# EAGLE design 1stschem (EAGLE 7.2.0)
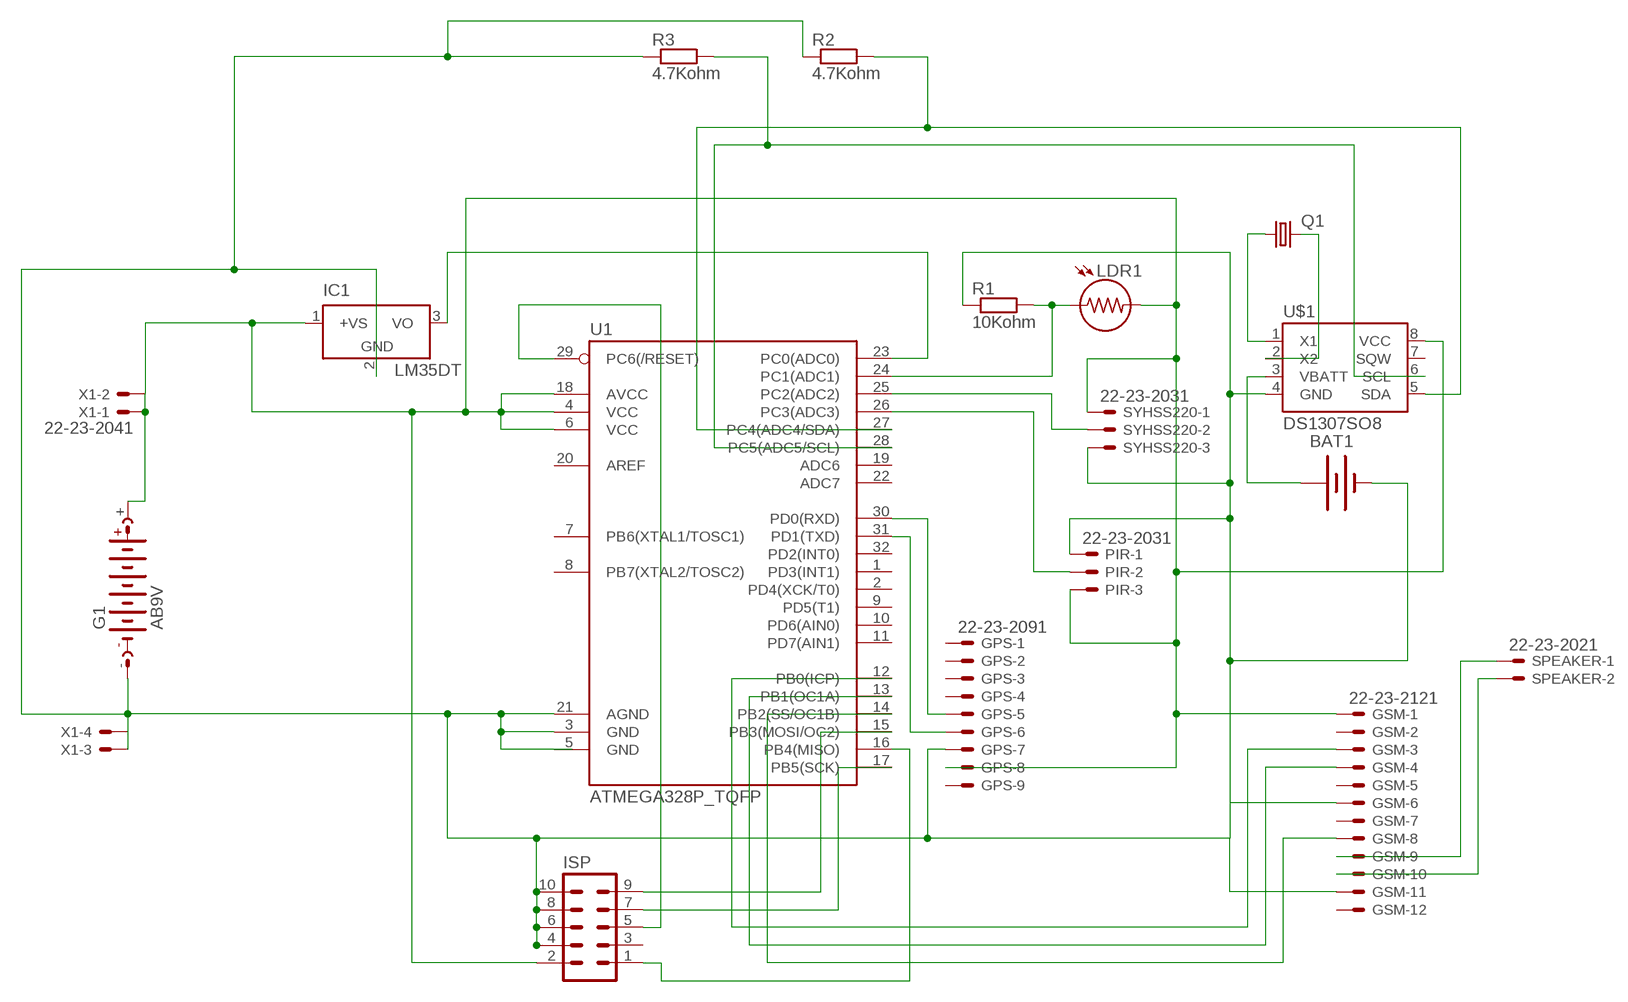
[diagram p0: schematic, sheet 1]

## Parts
BAT1  BATTERY20PTH  [BATTCOM_20MM_PTH]
G1  AB9V  [AB9V]
GPS  22-23-2091  [22-23-2091]
GSM  22-23-2121  [22-23-2121]
IC1  LM35DT  [TO220V]
ISP  ML10  [ML10]
LDR1  LDR5MM  [LDR338-54C]
PIR  22-23-2031  [22-23-2031]
Q1  CRYSTALTC26H  [TC26H]
R1  10Kohm  6MM-EU4  [R0207/4]
R2  4.7Kohm  6MM-EU4  [R0207/4]
R3  4.7Kohm  6MM-EU4  [R0207/4]
SPEAKER  22-23-2021  [22-23-2021]
SYHSS220  22-23-2031  [22-23-2031]
U1  ATMEGA328P_TQFP  [TQFP32-08]
U$1  DS1307SO8  [SO08]
X1  22-23-2041  [22-23-2041]

## Nets
N$2: BAT1.2(-) G1.- GPS.7 GSM.6 GSM.11 IC1.2(GND) ISP.4 ISP.6 ISP.8 ISP.10 PIR.1 R1.1 R2.1 R3.1 SYHSS220.3 U1.3(GND) U1.21(AGND) U$1.4(GND) X1.3 X1.4
N$3: GPS.5 U1.30(PD0(RXD))
N$4: IC1.3(VO) U1.23(PC0(ADC0))
N$5: LDR1.1 R1.2 U1.24(PC1(ADC1))
N$6: GPS.6 U1.31(PD1(TXD))
N$7: SYHSS220.2 U1.25(PC2(ADC2))
N$8: PIR.2 U1.26(PC3(ADC3))
N$9: R2.2 U1.27(PC4(ADC4/SDA)) U$1.5(SDA)
N$10: R3.2 U1.28(PC5(ADC5/SCL)) U$1.6(SCL)
N$11: GSM.3 U1.12(PB0(ICP))
N$12: Q1.1 U$1.1(X1)
N$13: Q1.2 U$1.2(X2)
N$14: GSM.4 U1.13(PB1(OC1A))
N$15: BAT1.1(+) U$1.3(VBATT)
N$16: GSM.8 U1.14(PB2(SS/OC1B))
N$17: GSM.10 SPEAKER.2
N$18: GSM.9 SPEAKER.1
N$19: G1.+ GPS.8 GSM.1 IC1.1(+VS) ISP.2 LDR1.2 PIR.3 SYHSS220.1 U1.4(VCC) U1.6(VCC) U1.18(AVCC) U$1.8(VCC) X1.1 X1.2
N$20: ISP.1 U1.16(PB4(MISO))
N$21: ISP.5 U1.29(PC6(/RESET))
N$22: ISP.7 U1.17(PB5(SCK))
N$23: ISP.9 U1.15(PB3(MOSI/OC2))
Unconnected: GPS.1 GPS.2 GPS.3 GPS.4 GPS.9 GSM.2 GSM.5 GSM.7 GSM.12 ISP.3 U1.1(PD3(INT1)) U1.2(PD4(XCK/T0)) U1.5(GND) U1.7(PB6(XTAL1/TOSC1)) U1.8(PB7(XTAL2/TOSC2)) U1.9(PD5(T1)) U1.10(PD6(AIN0)) U1.11(PD7(AIN1)) U1.19(ADC6) U1.20(AREF) U1.22(ADC7) U1.32(PD2(INT0)) U$1.7(SQW)

## Library data of the parts
BAT1 = SparkFun:BATTERY: Battery Holders Various common sizes : AA, AAA, 20mm coin cell and 12mm coin cell.
G1 = gm-supply:AB9V: 9-V BATTERY CLIP
GPS = con-molex:22-23-2091: .100" (2.54mm) Center Header - 9 Pin; MF: MOLEX; MPN: 22-23-2091; OC_FARNELL: 1756827; OC_NEWARK: 56H0450
GSM = con-molex:22-23-2121: .100" (2.54mm) Center Header - 12 Pin; MF: MOLEX; MPN: 22-23-2121; OC_FARNELL: 1462935; OC_NEWARK: 56H0456
IC1 = lm35:LM35: Single-Supply Centigrade Temperature Sensor Vout = (10mV/°C x Temp °C) +5mmmV Source: http://www.national.com/ds/LM/LM35.pdf
ISP = con-harting-ml:ML10: HARTING; OC_FARNELL: unknown; OC_NEWARK: unknown
LDR1 = gm-resistors:LDR
PIR SYHSS220 = con-molex:22-23-2031: .100" (2.54mm) Center Header - 3 Pin; MF: MOLEX; MPN: 22-23-2031; OC_FARNELL: 1462950; OC_NEWARK: 30C0862
Q1 = crystal:CRYSTAL: CRYSTAL; OC_FARNELL: unknown; OC_NEWARK: unknown
R1-R3 = gm-resistors:6MM-EU: 6mm Resistors (European schematic symbol) Leads spaced 1-6 holes apart for 0.1" perfboard. Suitable for 1/4 watt resistors.
SPEAKER = con-molex:22-23-2021: .100" (2.54mm) Center Header - 2 Pin; MF: MOLEX; MPN: 22-23-2021; OC_FARNELL: 1462926; OC_NEWARK: 25C3832
U1 = SparkFun-DigitalIC:ATMEGA328P_TQFP; PROD_ID: IC-09069
U$1 = SparkFun:DS1307
X1 = con-molex:22-23-2041: .100" (2.54mm) Center Header - 4 Pin; MF: MOLEX; MPN: 22-23-2041; OC_FARNELL: 1462920; OC_NEWARK: 38C0355

## Board
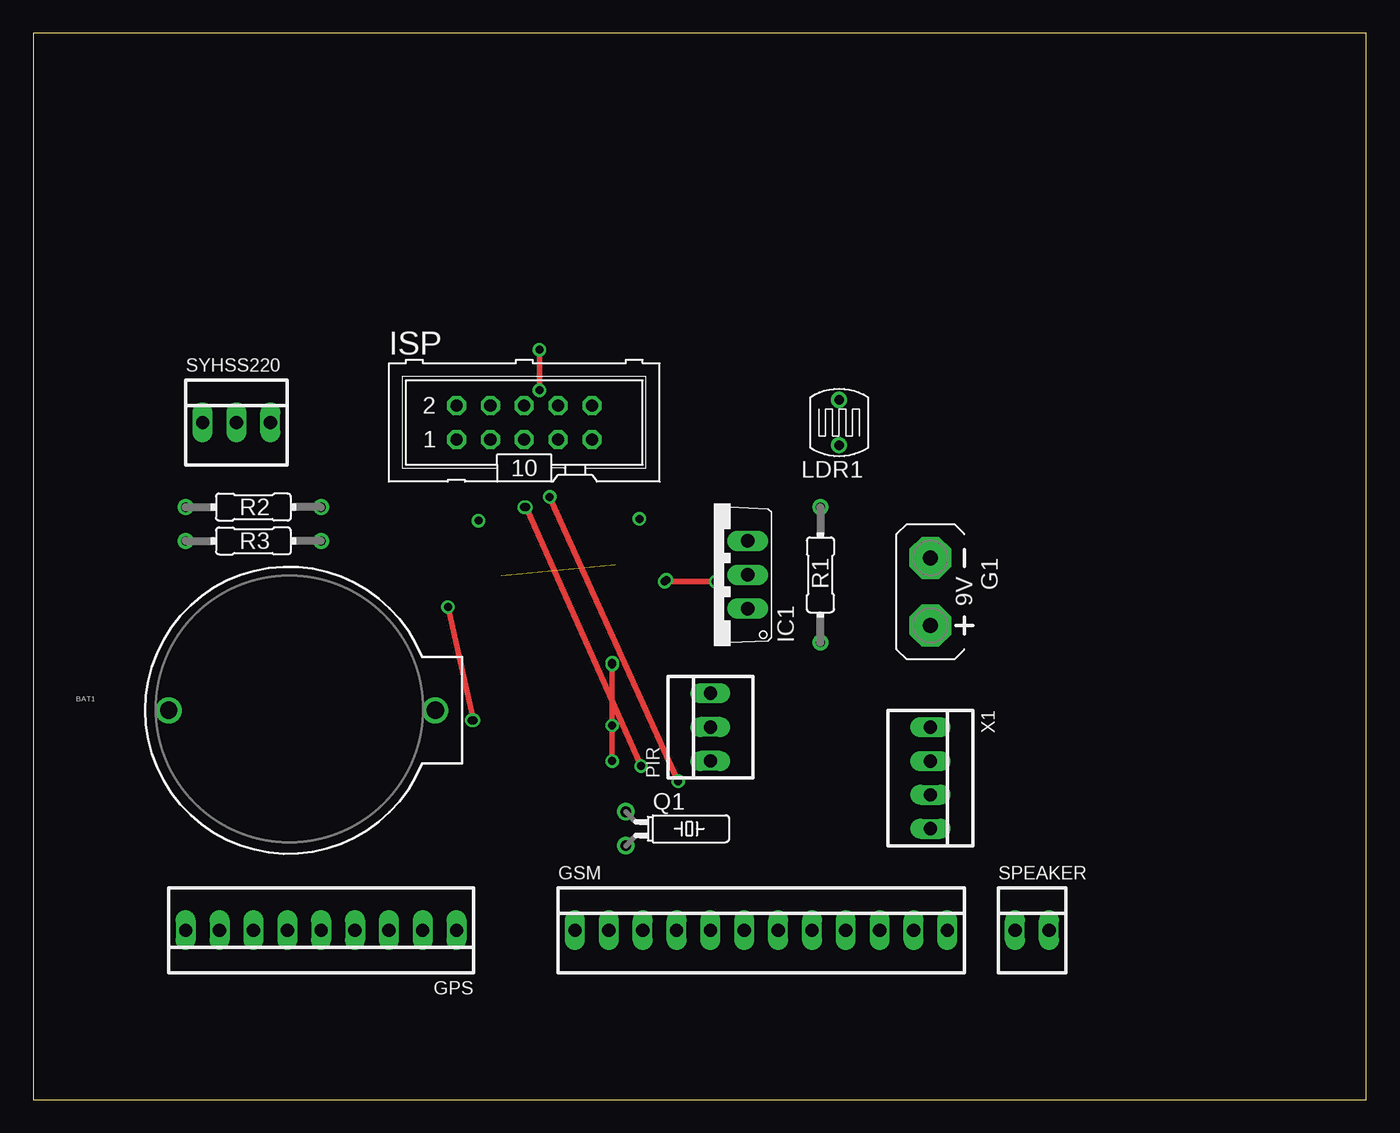
[diagram p1: board, top side]
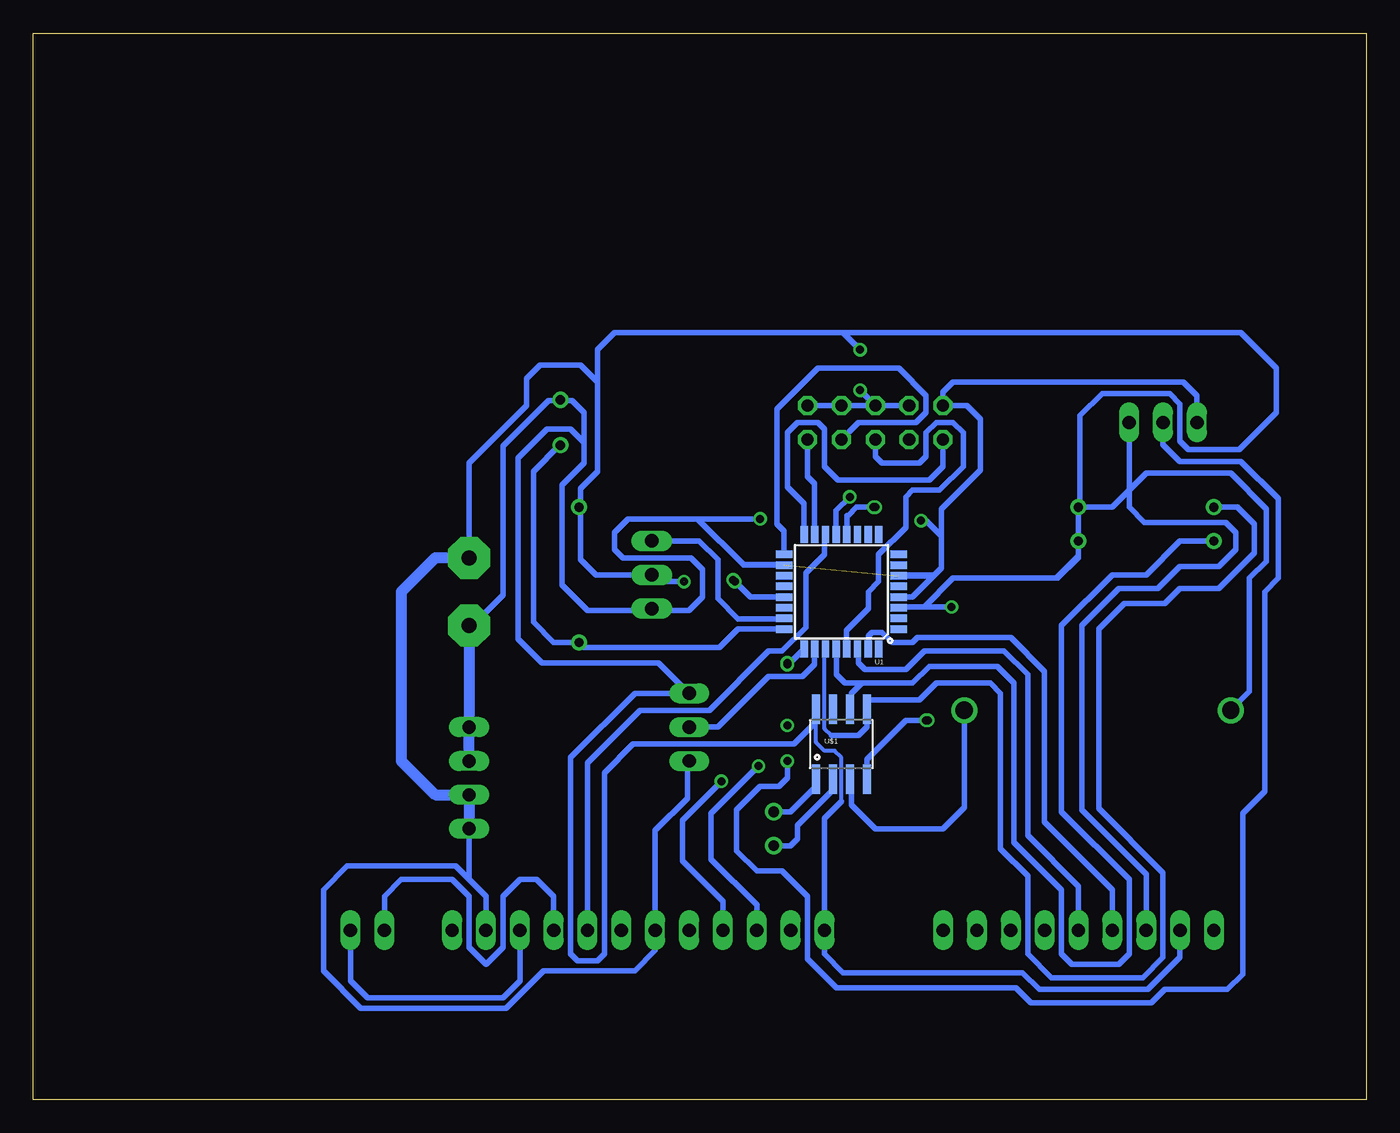
[diagram p2: board, bottom side, seen from below]

Size 100 x 80 mm. Coordinates in mm from the lower left corner, seen from the top.
Outline: 0,0 100,0 100,80 0,80 0,0
Copper layers (1*16): Top 0.035mm / dielectric 1.5mm / Bottom 0.035mm
Design rules "default": minimum track width 10mil, minimum drill 24mil, track to track 8mil, track to pad 8mil, pad to pad 8mil, via to via 8mil, smd to smd 8mil, copper to edge 40mil, drill to drill 8mil, minimum pad ring 10mil, minimum via ring 8mil, stop-mask expansion 4mil, vias tented up to drill 0mil, thermal gap 10mil

### Footprints (pad centres in the part's own frame; a part is rotated, then mirrored left to right if it is on the bottom)
BATTCOM_20MM_PTH = drill 1.3: 1 20,0; 2 0,0
AB9V = drill 1.118 pad 3.15 octagon: + 0,2.54; - 0,-2.54
22-23-2091 = drill 1 long: 1 -10.16,0; 2 -7.62,0; 3 -5.08,0; 4 -2.54,0; 5 0,0; 6 2.54,0; 7 5.08,0; 8 7.62,0; 9 10.16,0
22-23-2121 = drill 1 long: 1 -13.97,0; 2 -11.43,0; 3 -8.89,0; 4 -6.35,0; 5 -3.81,0; 6 -1.27,0; 7 1.27,0; 8 3.81,0; 9 6.35,0; 10 8.89,0; 11 11.43,0; 12 13.97,0
TO220V = drill 1.016 long: 1 -2.54,-2.54; 2 0,-2.54; 3 2.54,-2.54
ML10 = drill 0.914 octagon: 1 -5.08,-1.27; 2 -5.08,1.27; 3 -2.54,-1.27; 4 -2.54,1.27; 5 0,-1.27; 6 0,1.27; 7 2.54,-1.27; 8 2.54,1.27; 9 5.08,-1.27; 10 5.08,1.27
LDR338-54C = drill 0.7: 1 0,1.702; 2 0,-1.702
22-23-2031 = drill 1 long: 1 -2.54,0; 2 0,0; 3 2.54,0
TC26H = drill 0.813: 1 -1.27,0; 2 1.27,0
R0207/4 = drill 0.7: 1 -5.08,0; 2 5.08,0
22-23-2021 = drill 1 long: 1 -1.27,0; 2 1.27,0
TQFP32-08 = smd 1.27 x 0.559: 1 -4.293,2.8; 2 -4.293,2; 3 -4.293,1.2; 4 -4.293,0.4; 5 -4.293,-0.4; 6 -4.293,-1.2; 7 -4.293,-2; 8 -4.293,-2.8; 17 4.293,-2.8; 18 4.293,-2; 19 4.293,-1.2; 20 4.293,-0.4; 21 4.293,0.4; 22 4.293,1.2; 23 4.293,2; 24 4.293,2.8 | smd 0.559 x 1.27: 9 -2.8,-4.293; 10 -2,-4.293; 11 -1.2,-4.293; 12 -0.4,-4.293; 13 0.4,-4.293; 14 1.2,-4.293; 15 2,-4.293; 16 2.8,-4.293; 25 2.8,4.293; 26 2,4.293; 27 1.2,4.293; 28 0.4,4.293; 29 -0.4,4.293; 30 -1.2,4.293; 31 -2,4.293; 32 -2.8,4.293
SO08 = smd 0.61 x 2.21: 1 -1.905,-2.616; 2 -0.635,-2.616; 3 0.635,-2.616; 4 1.905,-2.616; 5 1.905,2.616; 6 0.635,2.616; 7 -0.635,2.616; 8 -1.905,2.616
22-23-2041 = drill 1 long: 1 -3.81,0; 2 -1.27,0; 3 1.27,0; 4 3.81,0

### Placement (x,y rotation side)
BAT1  10.16,29.21 0 top
G1  67.31,38.1 180 top
GPS  21.59,12.7 180 top
GSM  54.61,12.7 0 top
IC1  51.05,39.37 90 top
ISP  36.83,50.8 0 top
LDR1  60.45,50.8 180 top
PIR  50.8,27.94 90 top
Q1  44.45,20.32 270 top
R1  59.05,39.37 270 top
R2  16.51,44.45 180 top
R3  16.51,41.91 180 top
SPEAKER  74.93,12.7 0 top
SYHSS220  15.24,50.8 0 top
U1  39.37,38.1 180 bottom
U$1  39.37,26.67 0 bottom
X1  67.31,24.13 270 top

### Tracks (layer width: path | path; a pad name or v marks a point on that pad's centre or on a via)
N$2  (via drill 0.6)  (1 unrouted)
  Top 0.406: v37.97,56.26 v37.97,53.21 | v47.37,38.86 51.18,38.86 | v31.11,36.96 v33.02,28.45
  Bottom 0.406: ISP.6 ISP.8 ISP.10 | GSM.11 66.04,15.24 67.31,16.51 | 67.31,16.51 X1.4 | 17.78,45.72 SYHSS220.3 | R3.1 R2.1 21.46,44.45 | 21.46,44.45 19.05,44.45 17.78,45.72 | 17.78,45.72 16.51,46.99 10.16,46.99 7.49,44.32 7.49,40.39 8.76,39.12 8.76,30.61 BAT1.2 | 67.31,16.51 68.33,17.53 76.45,17.53 78.23,15.75 78.23,9.65 75.44,6.86 64.52,6.86 61.72,9.65 54.86,9.65 53.34,11.18 GSM.6 53.34,20.19 50.93,22.61 50.93,25.27 PIR.1 | R3.1 21.59,40.77 | 21.59,40.77 21.59,40.64 23.11,39.12 23.24,39.12 | 33.15,36.96 30.99,39.12 23.24,39.12 | 33.15,36.96 35.02,36.96 U1.3 | 68.33,40.64 68.33,40.39 67.31,40.39 G1.- 67.31,47.75 62.99,52.07 62.99,54.1 61.98,55.12 58.93,55.12 57.66,53.85 | 57.66,53.85 57.66,47.12 58.93,45.85 58.93,44.58 R1.1 58.93,44.32 58.93,40.51 57.78,39.37 IC1.2 53.34,39.37 52.83,38.86 51.18,38.86 | GPS.7 16.51,16.89 21.34,21.72 21.34,35.56 18.54,38.35 15.62,38.35 13.97,40.01 11.05,40.01 9.78,41.27 9.78,42.55 10.54,43.31 16.64,43.31 17.78,44.45 17.78,45.72 | 23.24,39.12 21.59,40.77 | R3.1 21.59,44.32 21.46,44.45 | 21.46,44.45 21.46,51.31 19.81,52.96 14.73,52.96 13.97,52.2 13.97,49.4 13.34,48.77 9.53,48.77 6.73,51.56 6.73,54.86 9.4,57.53 39.24,57.53 | 39.24,57.53 56.39,57.53 57.66,56.26 57.66,53.85 | ISP.4 ISP.6 | ISP.6 v37.97,53.21 | v37.97,56.26 39.24,57.53 | U1.21 46.21,37.7 v47.37,38.86 | U$1.4 37.47,25.53 34.54,28.45 v33.02,28.45 | 33.15,36.96 v31.11,36.96
  Bottom 0.813: X1.4 X1.3 69.85,22.86 72.39,25.4 72.39,38.1 69.85,40.64 68.33,40.64 G1.-
N$3
  Bottom 0.406: GPS.5 21.59,16 25.4,19.81 25.4,31.88 27.18,33.66 33.15,33.66 34.54,32.26 37.59,32.26 38.1,32.77 38.1,33.74 U1.30
N$4
  Bottom 0.406: IC1.3 50.04,41.91 48.64,40.51 48.64,37.59 47.12,36.07 43.7,36.07 U1.23
N$5
  Bottom 0.406: U1.24 47.12,35.3 48.51,33.91 58.67,33.91 R1.2 60.96,34.29 62.48,35.81 62.48,47.12 60.5,49.1 LDR1.1
N$6
  Bottom 0.406: 37.34,33.77 U1.31 37.34,33.84 37.34,34.8 37.08,35.05 36.32,35.05 35.56,34.29 34.04,34.29 33.66,34.67 26.67,34.67 24.13,32.13 24.13,20.83 19.05,15.75 GPS.6
N$7  (via drill 0.6)
  Top 0.406: v43.43,25.4 v43.43,32.64
  Bottom 0.406: SYHSS220.2 15.24,49.15 13.97,47.88 9.4,47.88 6.6,45.09 6.6,39.12 7.62,38.1 7.62,23.11 9.27,21.46 9.27,9.4 10.41,8.26 15.11,8.26 16.13,7.24 25.15,7.24 26.29,8.38 39.75,8.38 41.91,10.54 41.91,15.24 43.81,17.14 45.72,17.14 47.24,18.67 47.24,21.72 45.47,23.5 44.07,23.5 43.43,24.13 v43.43,25.4 | v43.43,32.64 43.34,32.64 U1.25
N$8
  Bottom 0.406: PIR.2 48.64,27.94 44.83,31.75 42.29,31.75 41.4,32.64 41.4,33.77 U1.26
N$9
  Bottom 0.305: 40.13,27.3 40.64,27.81 40.64,33.74
  Bottom 0.406: 40.13,27.3 38.1,27.3 37.47,27.94 U$1.5 37.47,29.97 33.53,29.97 32.26,31.24 28.19,31.24 27.43,30.48 27.43,18.8 25.4,16.76 25.4,10.92 23.62,9.14 16.76,9.14 15.24,10.67 15.24,17.02 20.07,21.84 20.07,35.31 18.16,37.21 15.11,37.21 13.97,38.35 11.05,38.35 8.38,41.02 8.38,43.18 9.65,44.45 R2.2 | 40.64,33.74 U1.27
N$10
  Bottom 0.406: R3.2 13.97,41.91 16.51,39.37 19.05,39.37 22.86,35.56 22.86,21.59 17.78,16.51 17.78,10.92 18.54,10.16 22.1,10.16 22.86,10.92 22.86,15.75 26.42,19.3 26.42,31.24 27.69,32.51 32.77,32.51 34.04,31.24 37.85,31.24 | 37.85,31.24 38.61,30.48 38.61,29.41 U$1.6 | 37.85,31.24 39.12,31.24 39.75,31.88 39.75,33.79 U1.28
N$11  (via drill 0.6)
  Top 0.406: v45.59,25.02 v36.96,44.45
  Bottom 0.406: U1.12 38.97,43.83 38.84,43.83 38.23,44.45 v36.96,44.45 | GSM.3 45.72,14.61 49.15,18.03 49.15,21.46 v45.59,25.02
N$12
  Bottom 0.406: Q1.1 43.18,21.59 41.4,23.37 41.4,23.93 U$1.1
N$13
  Bottom 0.406: Q1.2 43.18,19.05 42.67,19.56 42.67,20.57 40.13,23.11 40.13,23.93 U$1.2
N$14  (via drill 0.6)
  Top 0.406: v48.39,23.88 v38.73,45.21
  Bottom 0.406: U1.13 39.77,44.18 v38.73,45.21 | GSM.4 48.26,14.86 51.31,17.91 51.31,20.95 v48.39,23.88
N$15
  Bottom 0.406: BAT1.1 30.16,21.91 31.75,20.32 36.83,20.32 38.61,22.1 38.61,23.93 U$1.3
N$16
  Bottom 0.406: GSM.8 58.42,25.27 54.48,29.21 49.28,29.21 44.83,33.66 43.81,33.66 42.04,35.43 42.04,39.5 40.64,40.89 40.64,42.32 U1.14
N$17
  Bottom 0.406: SPEAKER.2 76.2,8.89 74.93,7.62 64.77,7.62 63.5,8.89 GSM.10
N$18
  Bottom 0.406: SPEAKER.1 73.66,15.24 72.39,16.51 68.58,16.51 67.31,15.24 67.31,11.43 66.04,10.16 64.77,11.43 64.77,15.24 63.5,16.51 62.23,16.51 60.96,15.24 GSM.9
N$19  (1 unrouted)
  Bottom 0.305: 39.37,22.35 39.37,25.65 39.88,26.16 40.64,26.16 41.27,26.8 41.27,28.32 U$1.8
  Bottom 0.406: GPS.8 13.97,10.67 16.38,8.26 24.51,8.26 25.78,9.53 39.24,9.53 40.64,10.92 GSM.1 40.64,21.08 39.37,22.35 | G1.+ 67.06,35.56 64.77,37.85 64.77,49.02 61.34,52.45 60.5,52.45 LDR1.2 60.4,52.45 59.56,52.45 58.67,51.56 58.67,49.28 | 46.74,40.13 43.69,40.13 U1.18 46.7,40.1 46.74,40.13 | 50.16,43.56 55.37,43.56 56.39,42.55 56.39,41.27 55.75,40.64 50.67,40.64 49.78,39.75 49.78,37.72 50.8,36.7 53.47,36.7 IC1.1 53.72,36.7 58.42,36.7 60.33,38.61 60.33,46.1 58.67,47.75 58.67,49.28 | 58.67,49.28 59.69,50.29 61.47,50.29 63.63,48.13 63.63,34.54 61.85,32.77 53.09,32.77 PIR.3 54.86,30.48 59.69,25.65 59.69,10.92 59.18,10.41 57.66,10.41 57.15,10.92 57.15,24.51 54.99,26.67 42.93,26.67 41.27,28.32 | SYHSS220.1 12.7,52.83 13.72,53.85 30.99,53.85 31.75,53.09 ISP.2 29.97,52.07 28.96,51.05 28.96,47.24 31.88,44.32 31.88,42.29 | U1.4 34.05,37.7 32.45,39.3 | 32.38,39.37 35.01,39.37 U1.6 32.45,39.3 | 32.45,39.3 32.38,39.37 | 32.38,39.37 31.88,39.88 31.88,42.29 | 46.74,40.13 50.16,43.56 | 50.16,43.56 45.59,43.56 | 31.88,42.29 33.02,43.43 33.27,43.43 33.4,43.43
  Bottom 0.813: X1.2 X1.1 G1.+
N$20
  Bottom 0.406: ISP.1 31.75,47.5 32.77,46.48 39.62,46.48 40.64,47.5 40.64,50.29 41.15,50.8 42.67,50.8 43.43,50.04 43.43,45.97 42.16,44.7 U1.16
N$21
  Bottom 0.406: ISP.5 36.83,48.26 36.32,47.75 33.53,47.75 33.02,48.26 33.02,50.04 32.26,50.8 30.99,50.8 30.23,50.04 30.23,47.5 32,45.72 34.04,45.72 34.54,45.21 34.54,42.93 36.58,40.89 36.58,38.86 37.34,38.1 37.34,36.83 38.99,35.18 38.99,33.83 U1.29
N$22
  Bottom 0.406: ISP.7 38.1,50.8 33.78,50.8 33.02,51.56 33.02,52.83 35.05,54.86 41.15,54.86 44.2,51.82 44.2,43.18 43.69,42.67 43.69,40.92 U1.17
N$23
  Bottom 0.406: ISP.9 41.91,46.74 41.4,46.23 41.4,42.42 U1.15
N$27  (via drill 0.6)
  other vias: 43.43,28.07
N$28  (via drill 0.6)
  other vias: 43.43,32.77
N$29  (via drill 0.6)
  other vias: 47.5,38.99
N$30  (via drill 0.6)
  other vias: 51.18,38.86
N$31  (via drill 0.6)
  other vias: 36.83,44.45
N$32  (via drill 0.6)
  other vias: 32.89,28.45
N$33  (via drill 0.6)
  other vias: 33.4,43.43
N$34  (via drill 0.6)
  other vias: 45.47,43.56